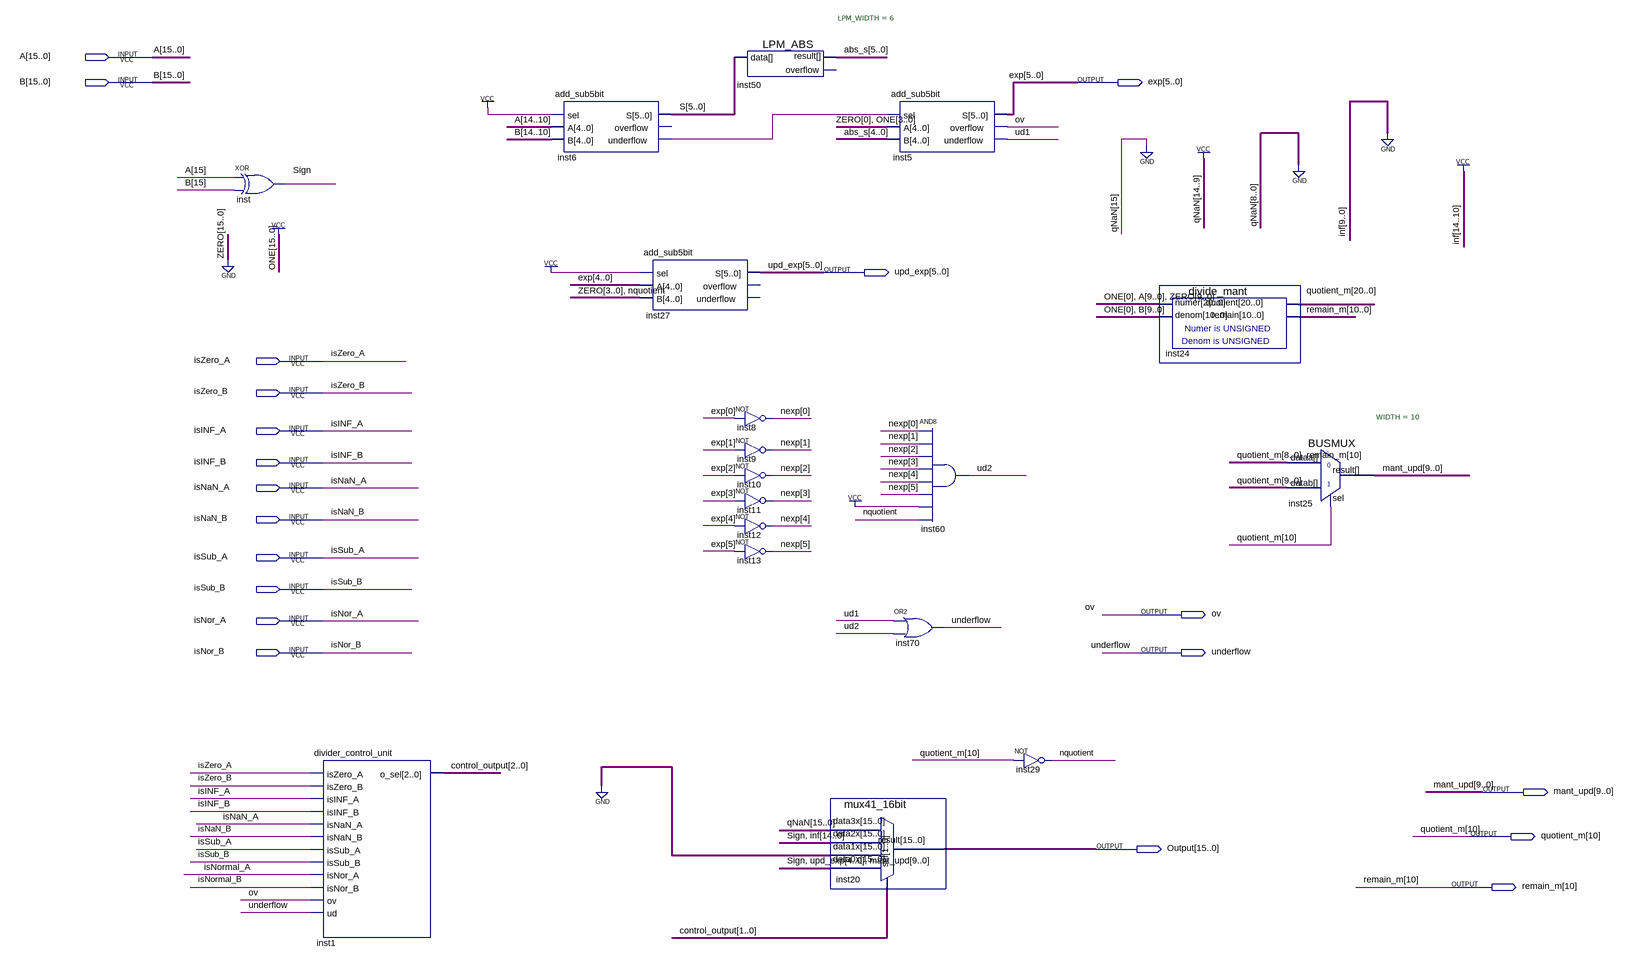
[diagram p0: schematic sheet]
// Quartus schematic Divider16bit.bdf as structural Verilog: 18 symbols, 20 pins
module Divider16bit (
  input  [15:0] A,
  input  [15:0] B,
  input  isZero_A,
  input  isZero_B,
  input  isINF_A,
  input  isINF_B,
  input  isNaN_A,
  input  isNaN_B,
  input  isSub_A,
  input  isSub_B,
  input  isNor_A,
  input  isNor_B,
  output [5:0] exp,
  output [5:0] upd_exp,
  output ov,
  output underflow,
  output [9:0] mant_upd,
  output [20:0] quotient_m,
  output [15:0] Output,
  output [10:0] remain_m
);

  wire inst6_underflow, isNormal_A, isNormal_B, nquotient, Sign, ud1, ud2;
  wire [2:0] control_output;
  wire [5:0] abs_s, nexp, S;

  xor inst (Sign, A[15], B[15]);
  divider_control_unit inst1 (
    .isZero_A(isZero_A), .isZero_B(isZero_B), .isINF_A(isINF_A), .isINF_B(isINF_B), .isNaN_A(isNaN_A),
    .isNaN_B(isNaN_B), .isSub_A(isSub_A), .isSub_B(isSub_B), .isNor_A(isNormal_A), .isNor_B(isNormal_B),
    .ov(ov), .ud(underflow), .o_sel(control_output));
  add_sub5bit inst6 (.sel(1'b1), .A(A[14:10]), .B(B[14:10]), .S(S), .underflow(inst6_underflow));  // open: overflow
  add_sub5bit inst27 (.sel(1'b1), .A(exp[4:0]), .B({4'b0000, nquotient}), .S(upd_exp));  // open: overflow, underflow
  LPM_ABS #(.LPM_WIDTH(6)) inst50 (.data(S), .result(abs_s));  // open: overflow
  not inst8 (nexp[0], exp[0]);
  not inst9 (nexp[1], exp[1]);
  not inst10 (nexp[2], exp[2]);
  not inst11 (nexp[3], exp[3]);
  not inst12 (nexp[4], exp[4]);
  not inst13 (nexp[5], exp[5]);
  mux41_16bit inst20 (
    .data3x(16'b0111111000000000), .data2x({Sign, 15'b111110000000000}), .data1x({16{1'b0}}),
    .data0x({Sign, upd_exp[4:0], mant_upd}), .sel(control_output[1:0]), .result(Output));
  add_sub5bit inst5 (.sel(inst6_underflow), .A(5'b01111), .B(abs_s[4:0]), .S(exp), .overflow(ov), .underflow(ud1));
  and inst60 (ud2, nexp[0], nexp[1], nexp[2], nexp[3], nexp[4], nexp[5], 1'b1, nquotient);
  or inst70 (underflow, ud1, ud2);
  not inst29 (nquotient, quotient_m[10]);
  divide_mant inst24 (
    .numer({1'b1, A[9:0], {10{1'b0}}}), .denom({1'b1, B[9:0]}), .quotient(quotient_m), .remain(remain_m));
  BUSMUX #(.WIDTH(10)) inst25 (
    .datab(quotient_m[9:0]), .sel(quotient_m[10]), .dataa({quotient_m[8:0], remain_m[10]}), .result(mant_upd));
endmodule
